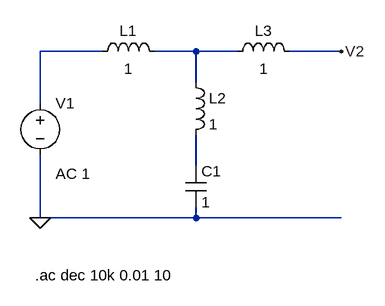
[diagram p0: schematic Punto3-A.asc]
Punto3-A.asc, the LTspice schematic file:
Version 4
SHEET 1 880 680
WIRE 0 112 -96 112
WIRE 144 112 80 112
WIRE 208 112 144 112
WIRE 368 112 288 112
WIRE 144 160 144 112
WIRE -96 192 -96 112
WIRE 144 288 144 240
WIRE -96 368 -96 272
WIRE 144 368 144 352
WIRE 144 368 -96 368
WIRE 368 368 144 368
FLAG -96 368 0
FLAG 368 112 V2
SYMBOL ind -16 128 R270
WINDOW 0 32 56 VTop 2
WINDOW 3 5 56 VBottom 2
SYMATTR InstName L1
SYMATTR Value 1
SYMBOL ind 128 144 R0
SYMATTR InstName L2
SYMATTR Value 1
SYMBOL ind 192 128 R270
WINDOW 0 32 56 VTop 2
WINDOW 3 5 56 VBottom 2
SYMATTR InstName L3
SYMATTR Value 1
SYMBOL cap 128 288 R0
SYMATTR InstName C1
SYMATTR Value 1
SYMBOL voltage -96 176 R0
WINDOW 123 24 124 Left 2
WINDOW 39 24 152 Left 2
SYMATTR InstName V1
SYMATTR Value ""
SYMATTR Value2 AC 1
TEXT -104 456 Left 2 !.ac dec 10k 0.01 10

The netlist it stands for:
* Punto3-A.asc
L1 N001 N002 1
L2 N002 N003 1
L3 N002 V2 1
C1 N003 0 1
V1 N001 0 AC 1
.ac dec 10k 0.01 10
.backanno
.end